# Altium schematic sheet Thermistor Linearization.SchDoc
size A
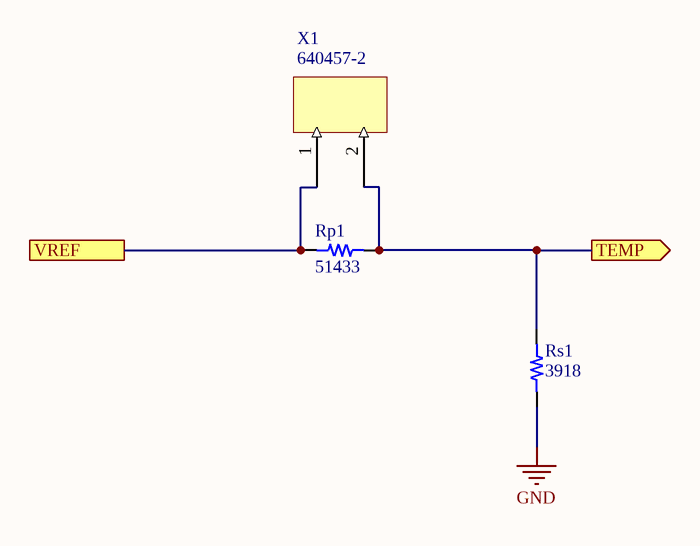
[diagram p0: Thermistor Linearization.SchDoc]

## Parts
Rp1  51433  [RES 0603/1608]
Rs1  3918  [RES 0603/1608]
X1  640457-2  [640457]

## Ports
TEMP (out), VREF

## Nets
GND: Rs1.1
TEMP: Rp1.2 Rs1.2 X1.2 ; port TEMP
VREF: Rp1.1 X1.1 ; port VREF

## Library data of the parts
Rp1 Rs1 = 1: id: 1; name: 0603 Resistor; percent tolerance: 5; package: 0603; quantity: 0
  Rp1: resistance: 51433
  Rs1: resistance: 3918
X1 = 37: 2 pin header; id: 37; numcontacts: 2; name: 640457-2; quantity: 0; createdby: Jason